# EasyEDA Pro project Quark.eprj

# Schematic Schematic1
Board Name: Board1; Create Date: 2025-03-06; Page Name: P1; Project Name: Quark; Schematic Name: Schematic1; Update Date: 2025-03-06; Company: EasyEDA.com; Page Size: A4; Version: V1.0
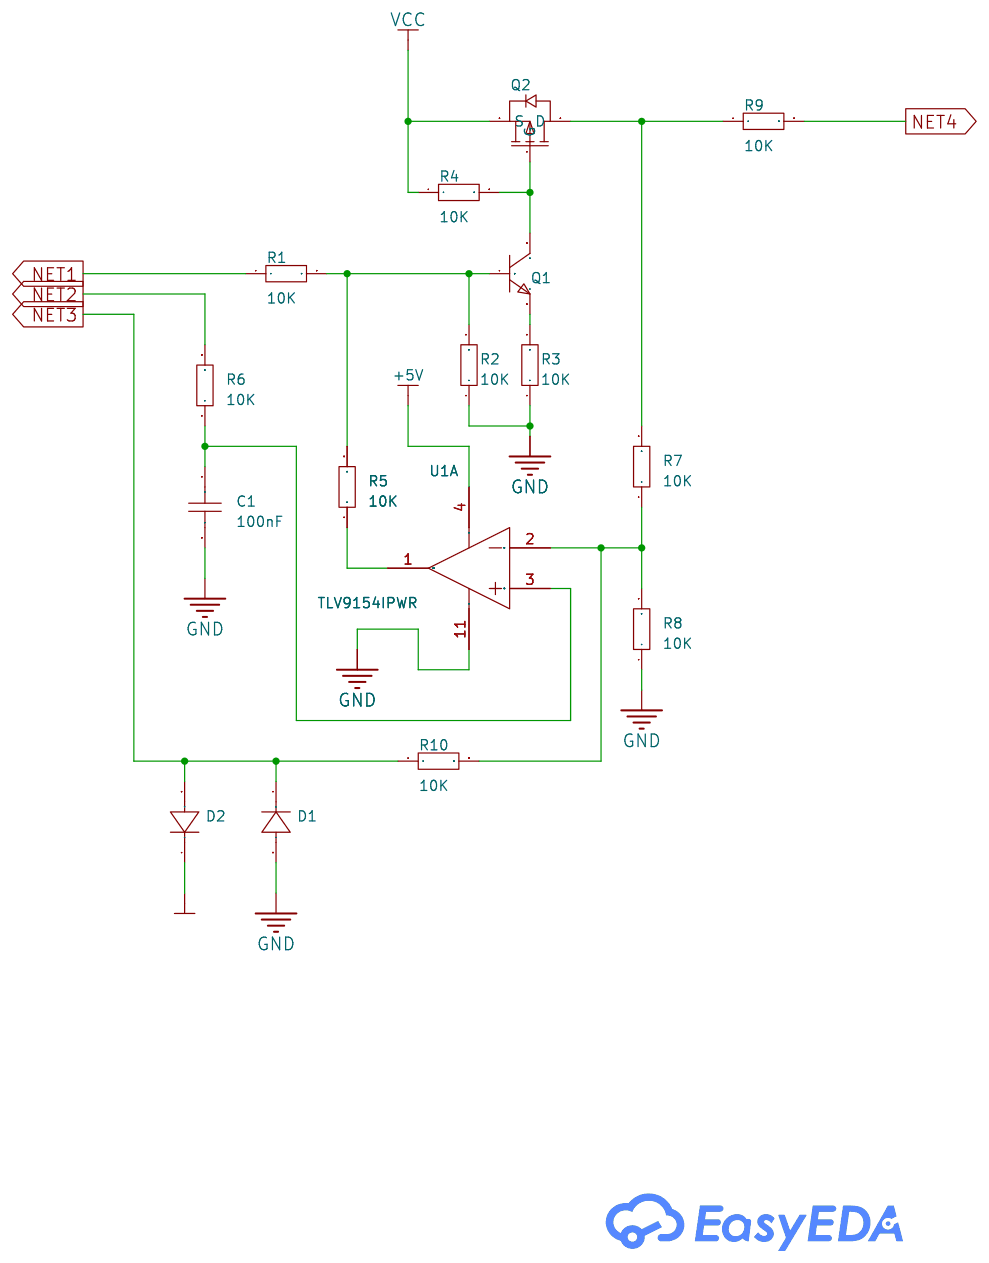
[diagram p0: schematic sheet]

## Parts
C1  100nF  [C0201]
D1  -  [DO-41_BD2.4-L4.7-P8.70-D0.9-RD]
D2  -  [DO-41_BD2.4-L4.7-P8.70-D0.9-RD]
Q1  -  [SOT-23_L2.9-W1.3-P1.90-LS2.4-BR]
Q2  -  [SOT-23_L2.9-W1.3-P1.90-LS2.4-BR]
R1  10K  [R0603]
R2  10K  [R0603]
R3  10K  [R0603]
R4  10K  [R0603]
R5  10K  [R0603]
R6  10K  [R0603]
R7  10K  [R0603]
R8  10K  [R0603]
R9  10K  [R0603]
R10  10K  [R0603]
U1  TLV9154IPWR  [TSSOP-14_L5.0-W4.4-P0.65-LS6.4-BL]  (section 1)

## Library data of the parts
C1 = CAP_0201: Supplier Footprint: 0201
D1 D2 = 1N4007: Supplier Footprint: DO-41
Q1 = S8050_NPN: Supplier Footprint: SOT-23
Q2 = P_MOS: Supplier Footprint: SOT-23-3L
R1-R10 = Res_0603: Supplier Footprint: 0603
U1 = TLV9154IPWR: Supplier Part: C2894368; Manufacturer: TI(德州仪器); Supplier Footprint: TSSOP-14-175mil; JLCPCB Part Class: Extended Part; Datasheet: https://www.ti.com/cn/lit/gpn/tlv9151; Supplier: LCSC; Number of Circuits: Four channels; Gain Bandwidth Product(GBP): 4.5MHz; Slew Rate(SR): 21V/us; Current - Input Bias(Ib): 10pA; Output Current: 75mA; Operating Temperature: -40℃~+125℃

## Nets
+5V: U1.4(V+)
GND: C1.2 D1.2(A) R2.1 R3.1 R8.1 U1.11(V-)
VCC: Q2.2(S) R4.1
+3.3: D2.1(K)
NET1: R1.1
NET2: R6.2
NET3: D1.1(K) D2.2(A) R10.1
NET4: R9.2
Net-(C1-1): C1.1 R6.1 U1.3(IN1+)
Net-(Q1-1): Q1.1(B) R1.2 R2.2 R5.2
Net-(Q1-2): Q1.2(E) R3.2
Net-(Q1-3): Q1.3(C) Q2.1(G) R4.2
Net-(Q2-3): Q2.3(D) R7.2 R9.1
Net-(R5-1): R5.1 U1.1(OUT1)
Net-(R7-1): R7.1 R8.2 R10.2 U1.2(IN1-)
